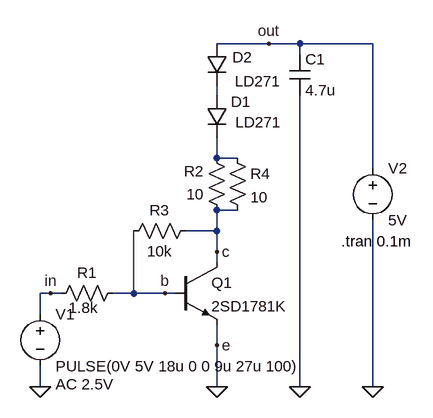
[diagram p0: schematic irled.asc]
irled.asc, the LTspice schematic file:
Version 4
SHEET 1 880 680
WIRE 208 -208 128 -208
WIRE 256 -208 208 -208
WIRE 368 -208 256 -208
WIRE 256 -192 256 -208
WIRE 128 -128 128 -144
WIRE 128 -32 128 -64
WIRE 160 -32 128 -32
WIRE 368 -16 368 -208
WIRE 160 48 128 48
WIRE 128 80 128 48
WIRE 128 80 80 80
WIRE 128 112 128 80
WIRE 128 128 128 112
WIRE -128 176 -144 176
WIRE -112 176 -128 176
WIRE 0 176 0 80
WIRE 0 176 -32 176
WIRE 48 176 0 176
WIRE 64 176 48 176
WIRE -144 208 -144 176
WIRE 128 256 128 224
WIRE -144 320 -144 288
WIRE 128 320 128 256
WIRE 256 320 256 -128
WIRE 368 320 368 64
FLAG 128 320 0
FLAG -144 320 0
FLAG 368 320 0
FLAG -128 176 in
FLAG 48 176 b
FLAG 128 256 e
FLAG 128 112 c
FLAG 208 -208 out
FLAG 256 320 0
SYMBOL npn 64 128 R0
SYMATTR InstName Q1
SYMATTR Value 2SD1781K
SYMBOL res -16 160 R90
WINDOW 0 0 56 VBottom 2
WINDOW 3 23 61 VTop 2
SYMATTR InstName R1
SYMATTR Value 1.8k
SYMBOL res 144 64 R180
WINDOW 0 36 76 Left 2
WINDOW 3 36 40 Left 2
SYMATTR InstName R2
SYMATTR Value 10
SYMBOL voltage -144 192 R0
WINDOW 123 24 124 Left 2
WINDOW 39 0 0 Left 2
SYMATTR Value2 AC 2.5V
SYMATTR InstName V1
SYMATTR Value PULSE(0V 5V 18u 0 0 9u 27u 100)
SYMBOL voltage 368 -32 R0
WINDOW 123 0 0 Left 2
WINDOW 39 0 0 Left 2
SYMATTR InstName V2
SYMATTR Value 5V
SYMBOL res 96 64 R90
WINDOW 0 0 56 VBottom 2
WINDOW 3 32 56 VTop 2
SYMATTR InstName R3
SYMATTR Value 10k
SYMBOL diode 112 -128 R0
WINDOW 0 38 9 Left 2
WINDOW 3 45 41 Left 2
SYMATTR InstName D1
SYMATTR Value LD271
SYMBOL diode 112 -208 R0
WINDOW 3 44 58 Left 2
WINDOW 0 40 21 Left 2
SYMATTR Value LD271
SYMATTR InstName D2
SYMBOL res 144 -48 R0
SYMATTR InstName R4
SYMATTR Value 10
SYMBOL cap 240 -192 R0
SYMATTR InstName C1
SYMATTR Value 4.7u
TEXT 320 96 Left 2 !.tran 0.1m

The netlist it stands for:
* irled.asc
Q1 c b 0 0 2SD1781K
R1 b in 1.8k
R2 c N002 10
V1 in 0 PULSE(0V 5V 18u 0 0 9u 27u 100) AC 2.5V
V2 out 0 5V
R3 c b 10k
D1 N001 N002 LD271
D2 out N001 LD271
R4 N002 c 10
C1 out 0 4.7u
.model D D
.lib standard.dio
.model NPN NPN
.model PNP PNP
.lib standard.bjt
.tran 0.1m
.backanno
.end